# Altium schematic sheet peripherals.SchDoc
size A
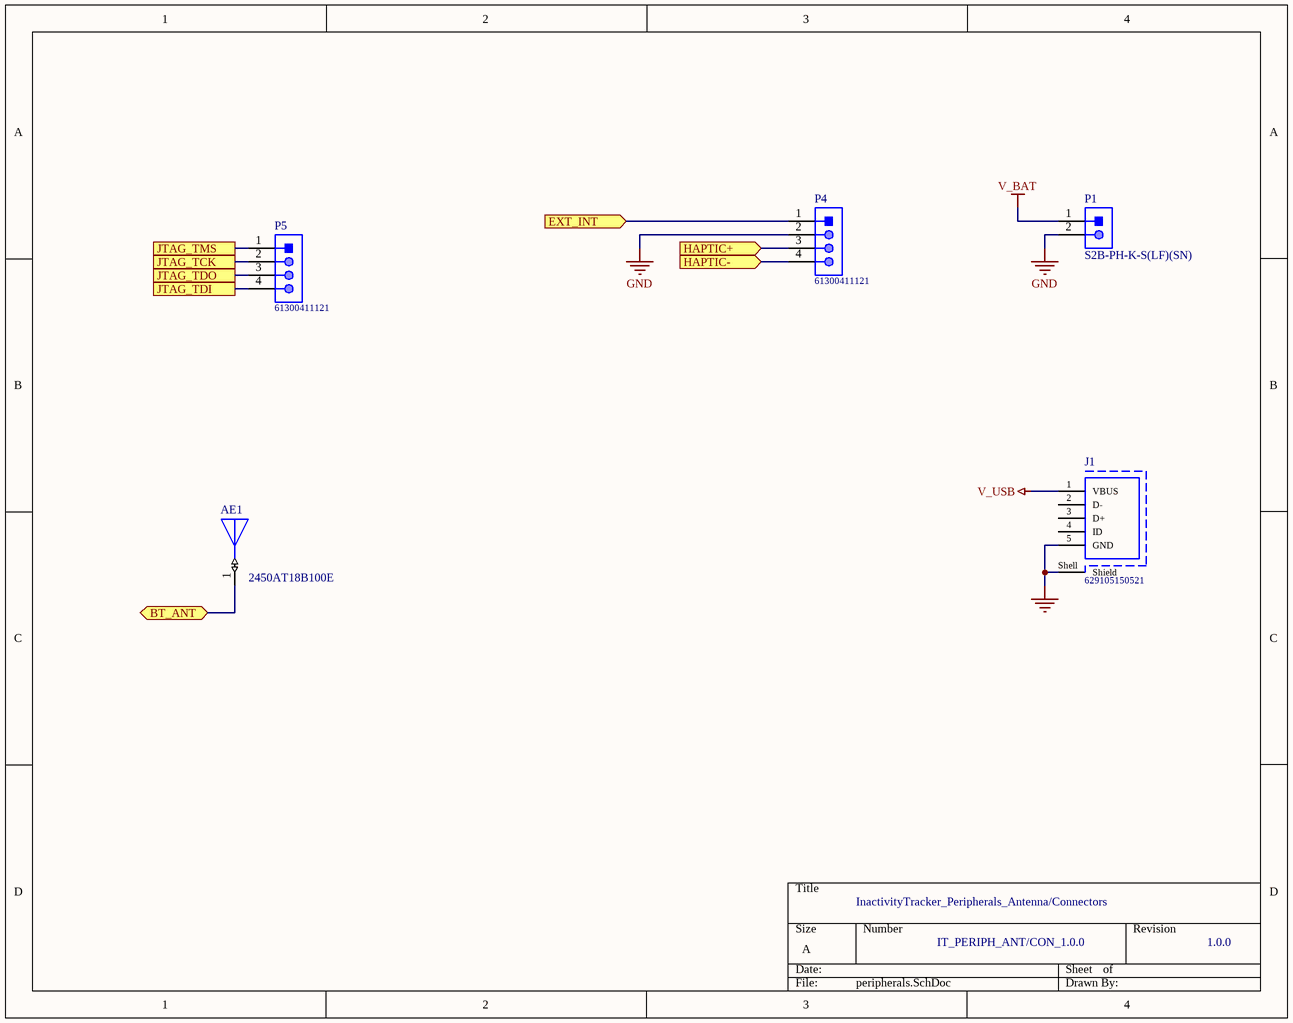
[diagram p0: peripherals.SchDoc]

## Parts
AE1  2450AT18B100E  [ANT_2450AT18B100E]
J1  629105150521  [629105150521]
P1  S2B-PH-K-S(LF)(SN)  [JST-S2B-PH-K-S_V]
P4  61300411121  [61300411121]
P5  61300411121  [61300411121]

## Ports
BT_ANT (bidir), EXT_INT (in), HAPTIC+ (in), HAPTIC- (in), JTAG_TCK, JTAG_TDI, JTAG_TDO, JTAG_TMS

## Nets
GND: J1.5(GND) J1.Shell(Shield) P1.2 P4.2
V_BAT: P1.1
V_USB: J1.1(VBUS)
BT_ANT: AE1.1 ; port BT_ANT
EXT_INT: P4.1 ; port EXT_INT
HAPTIC+: P4.3 ; port HAPTIC+
HAPTIC-: P4.4 ; port HAPTIC-
JTAG_TCK: P5.2 ; port JTAG_TCK
JTAG_TDI: P5.4 ; port JTAG_TDI
JTAG_TDO: P5.3 ; port JTAG_TDO
JTAG_TMS: P5.1 ; port JTAG_TMS

Not connected (* = marked no-connect by the designer): J1 2(D-) 3(D+) 4(ID)

## Notes on the sheet
- InactivityTracker_Peripherals_Antenna/Connectors
- IT_PERIPH_ANT/CON_1.0.0
- 1.0.0

## Library data of the parts
AE1 = 2450AT18B100E: JOHANSON TECHNOLOGY - 2450AT18B100E - ANTENNA, CERAMIC, 2.45GHZ; Number of Bands: 1; Return Loss: -9.5dB; Max Power Dissipation: 3W; Max Frequency: 2.5GHz; Gain: -0.5dB; Impedance: 50R; Bandwidth: 100MHz; Supplier 1: Digi-Key; Manufacturer: Johanson; Manufacturer Part Number: 2450AT18B100E; RoHS: Yes; Category: RF Antennas; Stock 1: 218439; Pricing 1: 1=0.56000, 10=0.49500, 25=0.46520, 100=0.37950, 250=0.35252, 500=0.30000, 1000=0.24000 (USD); Mount: Surface Mount; Case/Package: CSMD; Contact Plating: Tin; Min Operating Temperature: -40°C; Max Operating Temperature: 85°C; Termination: Solder; Frequency: 2.45GHz; Package Quantity: 1; Packaging: Tape and Reel; Power Rating: 3W; Length: 3.2mm; Height: 0.051inch; Width: 1.6mm; Radiation Hardening: No; REACH SVHC: No SVHC; ComponentLink1URL: https://datasheet.ciiva.com/24025/antenna-2450at18b100-242422-24025839.pdf?src-supplier=Mouser; ComponentLink1Description: https://datasheet.ciiva.com/24025/antenna-2450at18b100-242422-24025839.pdf?src-supplier=Mouser; ComponentLink2URL: https://datasheet.ciiva.com/1124/1318299-1124918.pdf?src-supplier=Element14; ComponentLink2Description: https://datasheet.ciiva.com/1124/1318299-1124918.pdf?src-supplier=Element14; Supplier Part Number 1: 712-1006-1-ND
J1 = CMP-1502-03252-1: Micro USB 2.0 Type B Receptacle WR-COM, Horizontal, SMT, with Pegs, High Current at Pin 1 & Pin 5; Manufacturer: Wurth Elektronik; Contact Resistance: 30mOhm; Rated Current: 3A; Working Voltage: 30VAC; Package Reference: 629105150521; Mounting Technology: SMT; Connector Type: MicroUSB2.0TypeB; Operating Temperature: -40to85degC; Orientation: Horizontal; Manufacturer URL: http://www.we-online.de; Datasheet URL: https://katalog.we-online.de/em/datasheet/629105150521.pdf; Part Number: 629105150521; Packaging: TapeandReel; Gender: Receptacle; Publisher: WurthElektronik
P1 = CMP-1755-00004-1: Male Header, Pitch 2 mm, 1 x 2 Position, Height 4.8 mm, Tail Length 3.4 mm, -25 to 85 degC, RoHS, Bulk; Case\Package: Radial; Tolerance: 20%; Capacitance: 10 uF; Voltage Rating (DC): 50 V; Packaging: Bulk; ComponentLink1URL: http://www.jst-mfg.com/product/pdf/eng/ePH.pdf; Radiation Hardening: No; Height: 11 mm; Package Quantity: 200; PackageDescription: Male Header, Pitch 2 mm, 1 x 2 Position, Height 4.8 mm, Tail Length 3.4 mm; PackageReference: S2B-PH-K-S; Diameter: 5 mm; Pins: 2; Mount: Through Hole; Max Operating Temperature: 85 degC; Min Operating Temperature: -40 degC; ComponentLink1Description: Datasheet; DatasheetVersion: Dec-12; Length: 11 mm; Lead Pitch: 2 mm; REACH SVHC: No SVHC; Voltage Rating: 50 V; RoHSCompliant: true
P4 P5 = CMP-1502-01064-1: THT Vertical Pin Header WR-PHD, Pitch 2.54 mm, Single Row, 4 pins; Manufacturer: Wurth Elektronik; Withstanding Voltage: 500VAC; Rated Current: 3A; Working Voltage: 250VAC; Pin Number: 4; Gender: Male; Contact Resistance: 20mOhm; Pitch: 2.54mm; Manufacturer URL: http://www.we-online.de; Operating Temperature: -40to105degC; Packaging: Bag; Mounting Technology: THT; Package Reference: 61300411121; Datasheet URL: https://katalog.we-online.de/em/datasheet/6130xx11121.pdf; Publisher: WurthElektronik; Part Number: 61300411121; Row Number: Single; Orientation: Vertical